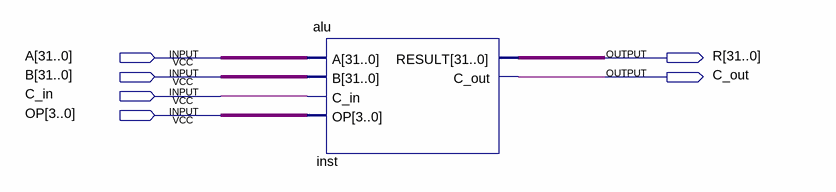
[diagram p0: schematic sheet]
// Quartus schematic riscv_top_level.bdf as structural Verilog: 1 symbols, 6 pins
module riscv_top_level (
  input  [31:0] A,
  input  [31:0] B,
  input  C_in,
  input  [3:0] OP,
  output [31:0] R,
  output C_out
);

  alu inst (.A(A), .B(B), .C_in(C_in), .OP(OP), .RESULT(R), .C_out(C_out));
endmodule
